# Altium schematic sheet PowerRegulation.SchDoc: Power Converter Main
size 431 x 279 mm; DocumentNumber: 10; SheetNumber: 10; SheetTotal: 18; ENG_APP_DATE: --/--/--; DSN_APP_DATE: --/--/--; CHK_APP_DATE: --/--/--
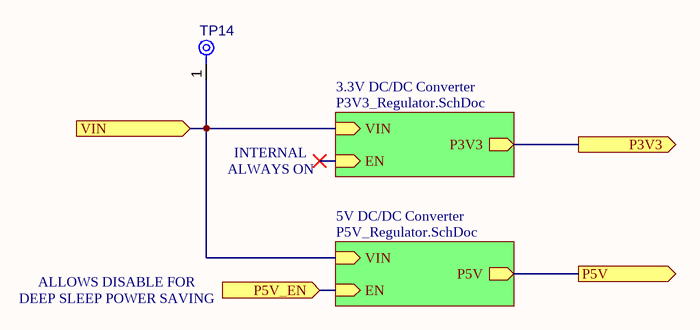
[diagram p0: PowerRegulation.SchDoc]

## Parts
TP14  TPAD6R-CIRCLED  [TP06R - Circled]  (value not drawn)  (no BOM)

## Sub-sheets
3.3V DC/DC Converter = P3V3_Regulator.SchDoc: VIN (in), P3V3 (out), EN (in)
5V DC/DC Converter = P5V_Regulator.SchDoc: VIN (in), P5V (out), EN (in)

## Ports
P3V3 (out), P5V (out), P5V_EN (in), VIN (in)

## Nets
P3V3: port P3V3, sheet 3.3V DC/DC Converter/P3V3
P5V: port P5V, sheet 5V DC/DC Converter/P5V
P5V_EN: port P5V_EN, sheet 5V DC/DC Converter/EN
VIN: TP14.1(TP) ; port VIN, sheet 3.3V DC/DC Converter/VIN, sheet 5V DC/DC Converter/VIN

## Notes on the sheet
- ALWAYS ON
- INTERNAL
- ALLOWS DISABLE FOR
- DEEP SLEEP POWER SAVING
- THIS DOCUMENT AND THE DATA DISCLOSED HEREIN OR HEREWITH IS THE PROPERTY OF APPLIED PHYSICS LAB - UNIVERSITY OF WASHINGTON.
- PROJECT
- TITLE
- FILE NAME
- SIZE
- B
- CAGE CODE
- DWG NO.
- SHEET
- OF
- REV

## Library data of the parts
TP14 = CMP-00028-00014-3: 0.6mm round with a silkscreen circle.; Pins: 1